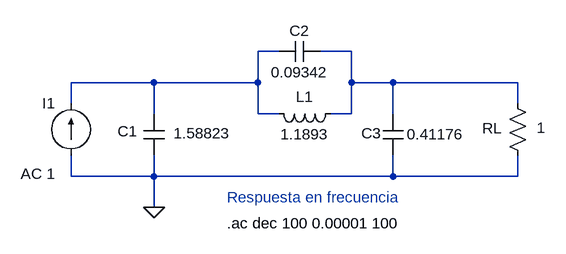
[diagram p0: schematic EJ2.asc]
EJ2.asc, the LTspice schematic file:
Version 4
SHEET 1 1016 680
WIRE 416 96 384 96
WIRE 528 96 480 96
WIRE 224 144 96 144
WIRE 384 144 384 96
WIRE 384 144 224 144
WIRE 528 144 528 96
WIRE 592 144 528 144
WIRE 784 144 592 144
WIRE 96 176 96 144
WIRE 784 176 784 144
WIRE 224 192 224 144
WIRE 384 192 384 144
WIRE 416 192 384 192
WIRE 528 192 528 144
WIRE 528 192 496 192
WIRE 592 192 592 144
WIRE 96 288 96 256
WIRE 224 288 224 256
WIRE 224 288 96 288
WIRE 592 288 592 256
WIRE 592 288 224 288
WIRE 784 288 784 256
WIRE 784 288 592 288
WIRE 224 336 224 288
FLAG 224 336 0
SYMBOL current 96 256 R180
WINDOW 0 24 80 Left 2
WINDOW 3 24 0 Left 2
WINDOW 123 24 -28 Left 2
WINDOW 39 0 0 Left 0
SYMATTR InstName I1
SYMATTR Value ""
SYMATTR Value2 AC 1
SYMBOL cap 240 256 R180
WINDOW 0 41 37 Left 2
WINDOW 3 -102 34 Left 2
SYMATTR InstName C1
SYMATTR Value 1.58823
SYMBOL cap 480 80 R90
WINDOW 0 0 32 VBottom 2
WINDOW 3 32 32 VTop 2
SYMATTR InstName C2
SYMATTR Value 0.09342
SYMBOL res 800 272 R180
WINDOW 0 40 58 Left 2
WINDOW 3 -27 59 Left 2
SYMATTR InstName RL
SYMATTR Value 1
SYMBOL ind 512 176 R90
WINDOW 0 5 56 VBottom 2
WINDOW 3 32 56 VTop 2
SYMATTR InstName L1
SYMATTR Value 1.1893
SYMBOL cap 576 192 R0
WINDOW 0 -33 30 Left 2
WINDOW 3 37 31 Left 2
SYMATTR InstName C3
SYMATTR Value 0.41176
TEXT 336 360 Left 2 !.ac dec 100 0.00001 100
TEXT 336 320 Left 2 ;Respuesta en frecuencia

The netlist it stands for:
* EJ2.asc
I1 0 N001 AC 1
C1 0 N001 1.58823
C2 N002 N001 0.09342
RL 0 N002 1
L1 N002 N001 1.1893
C3 N002 0 0.41176
.ac dec 100 0.00001 100
* Respuesta en frecuencia
.backanno
.end